# EasyEDA Pro project 独轮驱动.epro

# Schematic 独轮驱动
Create Date: 2024-05-19; Page Name: P1; Project Name: 独轮驱动; Schematic Name: 独轮驱动; Update Date: 2024-06-09; Company: 嘉立创EDA; Page Size: A3; Version: V1.0
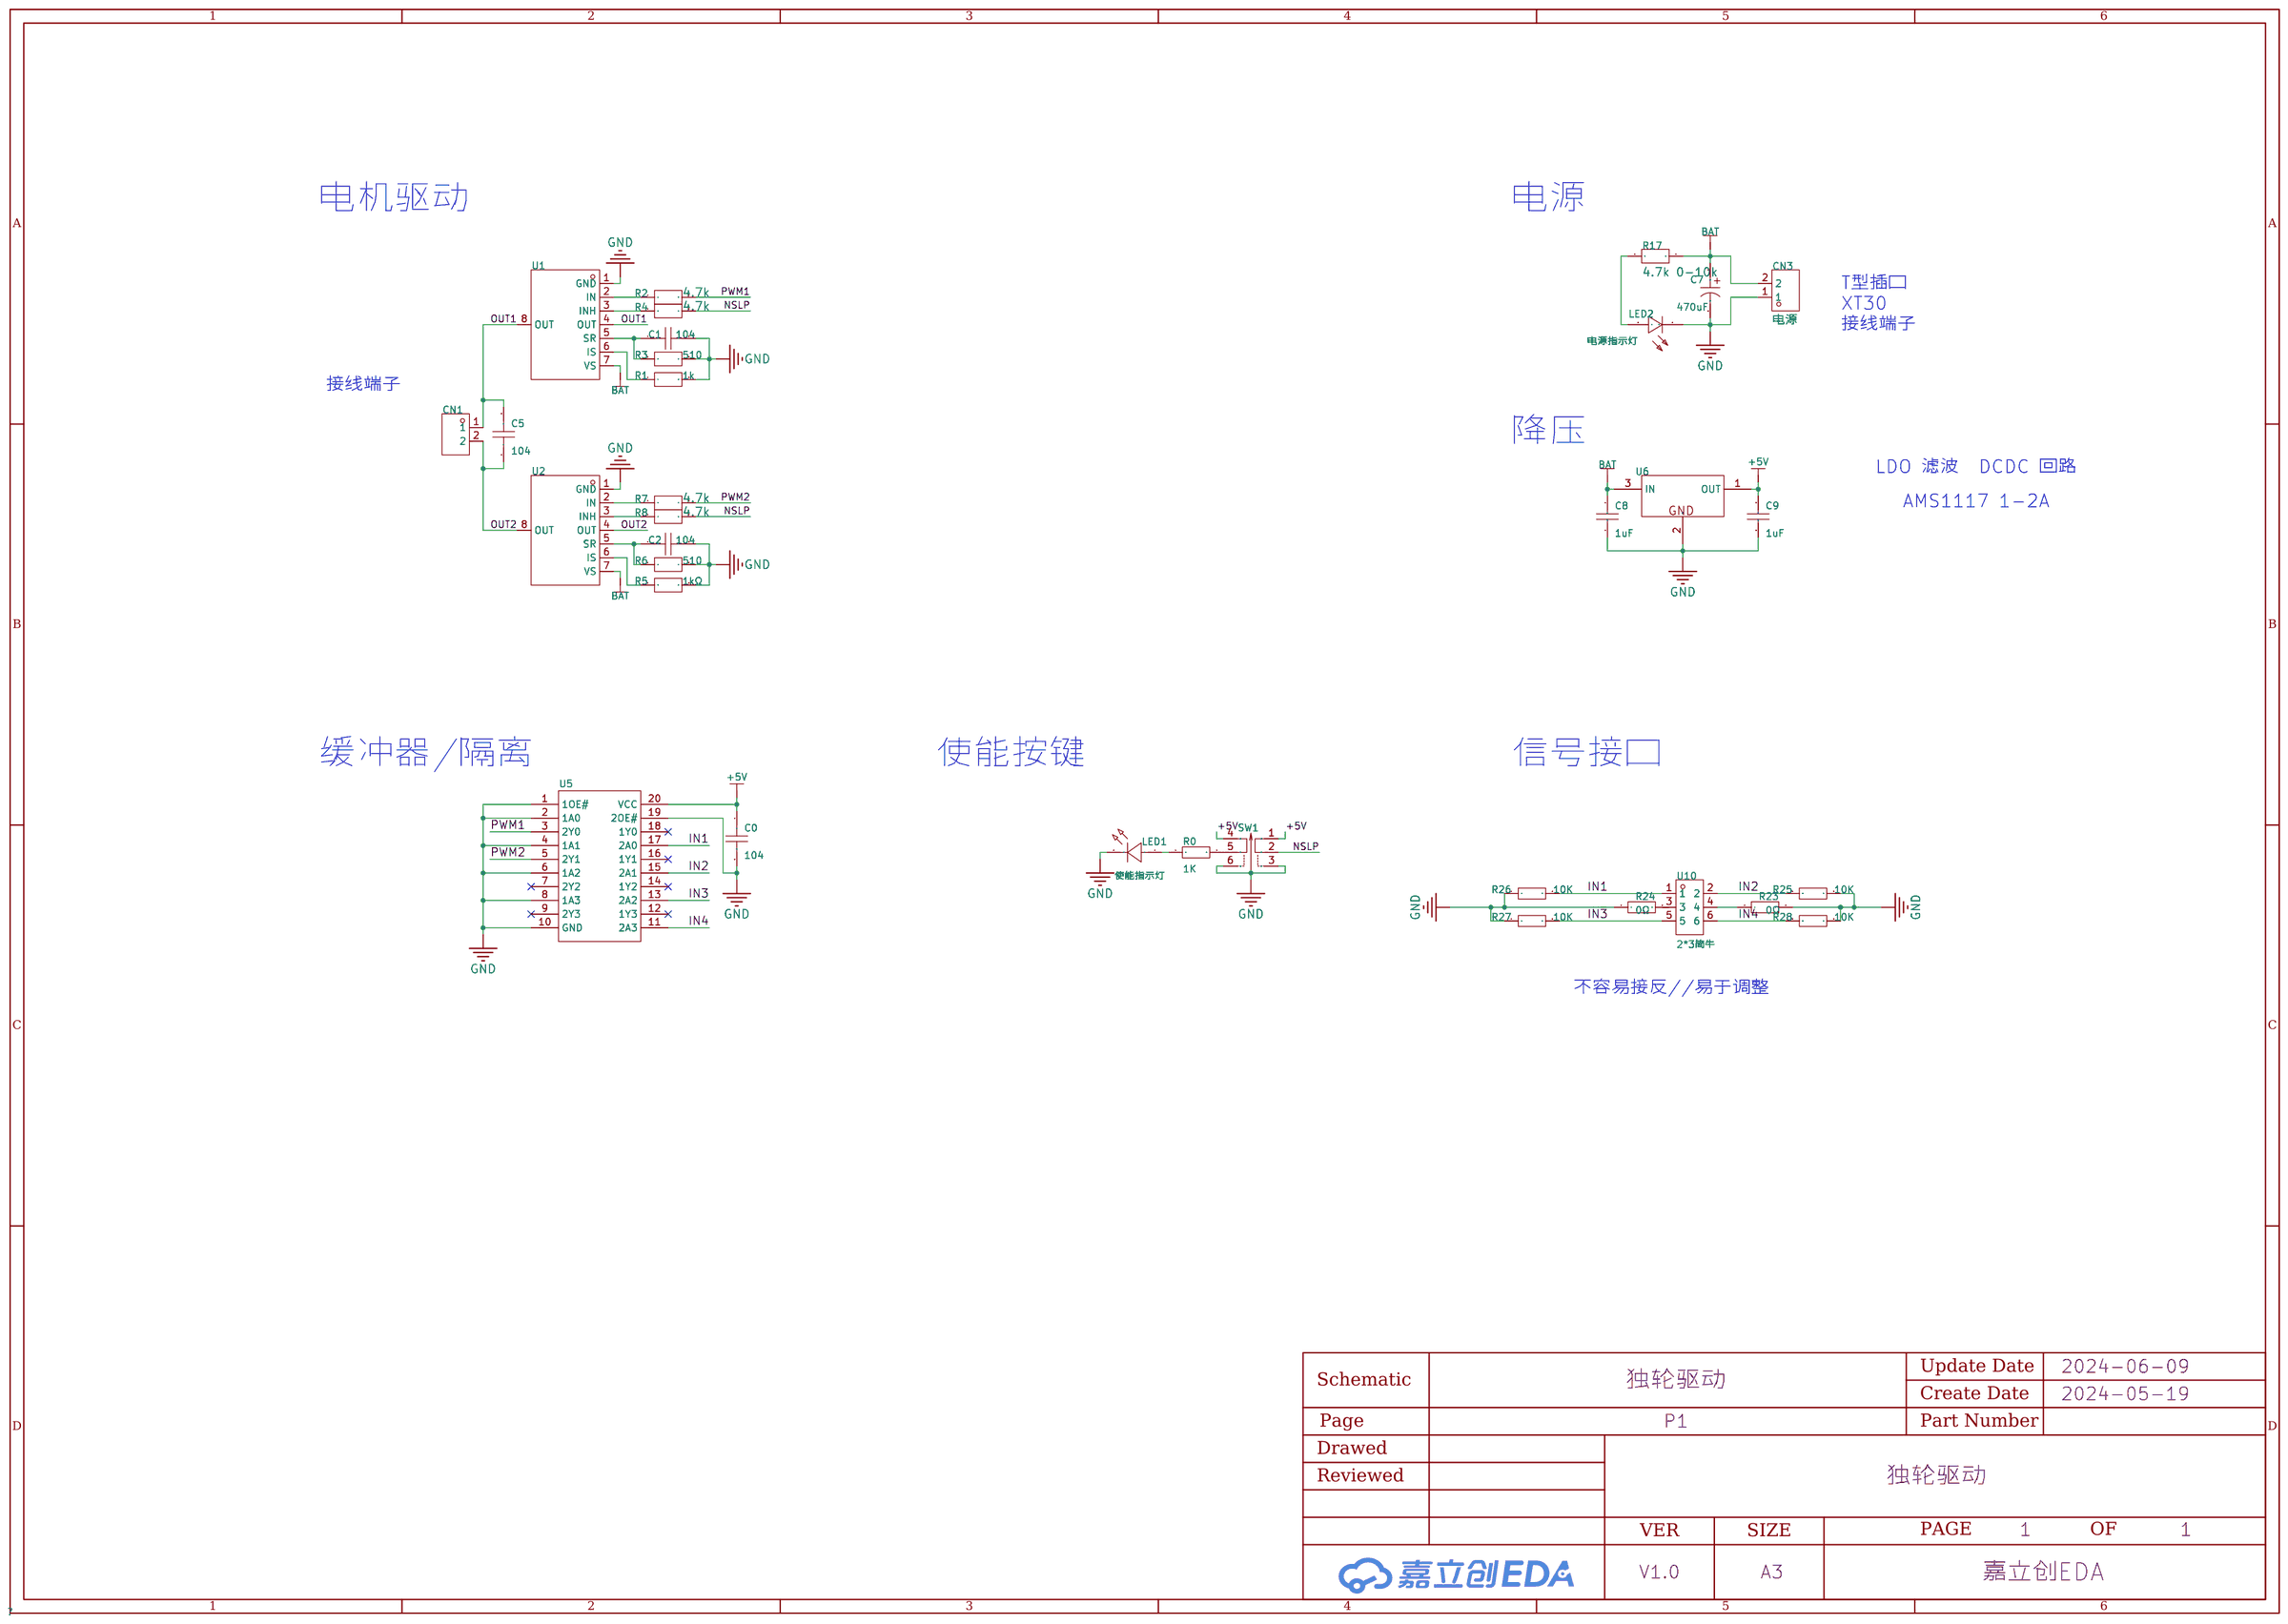
[diagram p0: schematic sheet]

## Parts
C0  104  [C0603]
C1  104  [C0603_1]
C2  104  [C0603_1]
C5  104  [C0603_1]
C7  470uF  [CAP-SMD_BD8.0-L8.3-W8.3-LS9.1-FD]
C8  1uF  [C0603_1]
C9  1uF  [C0603_1]
CN1  电机1  [CONN-TH_XT30U-M_1]
CN3  电源  [CONN-TH_XT30U-M_1]
LED1  使能指示灯  [LED-SMD_L1.6-W0.8-FD_GREEN]
LED2  电源指示灯  [LED0603-RD_RED]
R0  1K  [R0603]
R1  1k  [R0603]
R2  4.7k  [R0603]
R3  510  [R0603]
R4  4.7k  [R0603]
R5  1kΩ  [R0603]
R6  510  [R0603]
R7  4.7k  [R0603]
R8  4.7k  [R0603]
R17  4.7k 0-10k  [R0603]
R23  0Ω  [r0603_1]
R24  0Ω  [r0603_1]
R25  10K  [r0603_1]
R26  10K  [r0603_1]
R27  10K  [r0603_1]
R28  10K  [r0603_1]
SW1  使能开关  [SW-TH_6P-L5.8-W5.8-P2.00-LS4.5-BL]
U1  BTN7971BAUMA1  [TO-263-7_L10.2-W10.4-P1.27-LS14.4-BR]
U2  BTN7971BAUMA1  [TO-263-7_L10.2-W10.4-P1.27-LS14.4-BR]
U5  74HC244PW,118  [TSSOP-20_L6.5-W4.4-P0.65-LS6.4-BL]
U6  -  [SOT-89-3_L4.5-W2.5-P1.50-LS4.2-BR]
U10  2*3简牛  [CONN-TH_6P-P2.54_KINGHELM_KH-2.54PH180-2X3P-L8.9]

## Library data of the parts
C0-C2 C5 = CAP_604: 容值:100nF;精度:±10%;额定电压:50V;温度系数:X7R;; Supplier Footprint: 0603
C7 = RVT1E471M0810: 容值:470uF;精度:±20%;额定电压:25V;电容体直径:-;电容体长度:-;纹波电流:-;等效串联电阻:-;工作寿命:-;; LCSC Part Name: 470uF ±20% 25V; Supplier Part: C696190; Manufacturer: HONOR(荣誉); Supplier Footprint: SMD,D8xL10.2mm; JLCPCB Part Class: 扩展库; Datasheet: https://atta.szlcsc.com/upload/public/pdf/source/20210521/C113284_25C86AE95FB541053FE695F13EA8E7D0.pdf; Supplier: LCSC; Tolerance: ±20%; Rated Voltage: 25V
C8 C9 = CL10A105KB8NNNC: 温度系数:X5R;精度:±10%;额定电压:50V;容值:1uF;; LCSC Part Name: 1uF(105)±10%50V; Supplier Part: C15849; Manufacturer: SAMSUNG(三星); Supplier Footprint: 0603; JLCPCB Part Class: 基础库; Datasheet: https://atta.szlcsc.com/upload/public/pdf/source/20160103/1457707679084.pdf; Supplier: LCSC; Temperature Coefficient: X5R; Tolerance: ±10%; Voltage Rated: 50V
CN1 CN3 = KF301-5.0-2P: 间距:5mm;排数:1;每排PIN数:2;安装方式:直针;额定电流:17A;额定电压:250V;线规 - AWG:14~22;线规 - mm?:1.5;工作温度范围:-30~+120;颜色:蓝色;; LCSC Part Name: 5mm 排数:1 每排P数:2 直针 可拼接 铜 环保; Supplier Part: C474881; Manufacturer: KEFA(科发); Supplier Footprint: P=5mm; JLCPCB Part Class: 扩展库; Datasheet: https://atta.szlcsc.com/upload/public/pdf/source/20200115/C474881_883EFE2003339C40FD1BEEEFC9A18423.pdf; Supplier: LCSC; Pitch: 5mm; Number of Rows: 1; Number of PINs Per Row: 2; Mounting Style: 直针; Current Rating (Max): 17A; Voltage Rating (Max): 250V; Wire Gauge - AWG: 14~22; Wire Gauge - mm?: 1.5; Operating Temperature Range: -30~+120; Color: 蓝色
LED1 = 19-213/GVC-AMNB/3T: LCSC Part Name: 绿色; Supplier Part: C883167; Manufacturer: EVERLIGHT(台湾亿光); Supplier Footprint: 0603; JLCPCB Part Class: 扩展库; Datasheet: https://atta.szlcsc.comnull; Supplier: LCSC
LED2 = NCD0603R1_C84263: 发光颜色:红灯;; LCSC Part Name: 红灯; Supplier Part: C84263; Manufacturer: 国星光电; Manufacturer Part: NCD0603R1; Supplier Footprint: 0603; JLCPCB Part Class: 扩展库; Datasheet: https://atta.szlcsc.com/upload/public/pdf/source/20200820/C84263_DABC6A75E58F576973B407FDBA283D60.pdf; Supplier: LCSC; Emitted Color: 红灯
R0 = Res_0603: Supplier Footprint: 0603
R1 R3 R6 = FRC0603J511 TS: 电阻类型:厚膜电阻;阻值:510Ω;精度:±5%;功率:100mW;温度系数:±100ppm/;最大工作电压:50V;工作温度范围:-55~+155;; LCSC Part Name: 510Ω ±5% 100mW; Supplier Part: C2907179; Manufacturer: FOJAN(富捷); Supplier Footprint: 0603; Datasheet: https://atta.szlcsc.com/upload/public/pdf/source/20211102/08480A48F159CF742D398A1E4DC90941.pdf; Supplier: LCSC; Type: 厚膜电阻; Tolerance: ±5%; Power(Watts): 100mW; Temperature Coefficient: ±100ppm/; Overload Voltage (Max): 50V; Operating Temperature Range: -55~+155
R2 R4 R7 R8 R17 = FRC0603J472 TS: LCSC Part Name: 4.7KΩ ±5%; Supplier Part: C2907166; Manufacturer: FOJAN(富捷); Supplier Footprint: 0603; JLCPCB Part Class: 扩展库; Datasheet: https://atta.szlcsc.com/upload/public/pdf/source/20211102/08480A48F159CF742D398A1E4DC90941.pdf; Supplier: LCSC
R5 = FRC0603J102 TS: 电阻类型:厚膜电阻;阻值:1kΩ;精度:±5%;功率:100mW;温度系数:±100ppm/;最大工作电压:50V;工作温度范围:-55~+155;; LCSC Part Name: 1kΩ ±5% 100mW; Supplier Part: C2907113; Manufacturer: FOJAN(富捷); Supplier Footprint: 0603; JLCPCB Part Class: 扩展库; Datasheet: https://atta.szlcsc.com/upload/public/pdf/source/20211102/08480A48F159CF742D398A1E4DC90941.pdf; Supplier: LCSC; Type: 厚膜电阻; Tolerance: ±5%; Power(Watts): 100mW; Temperature Coefficient: ±100ppm/; Overload Voltage (Max): 50V; Operating Temperature Range: -55~+155
R23-R28 = ERJ3GEY0R00V: 电阻类型:厚膜电阻;阻值:0Ω;精度:-;功率:100mW;温度系数:-;最大工作电压:150V;工作温度范围:-55~+155;; LCSC Part Name: 0Ω 100mW; Supplier Part: C122704; Manufacturer: PANASONIC(松下); Supplier Footprint: 0603; JLCPCB Part Class: 扩展库; Datasheet: https://atta.szlcsc.com/upload/public/pdf/source/20171106/C122704_15099694152271094016.pdf; Supplier: LCSC; Type: 厚膜电阻; Power(Watts): 100mW; Overload Voltage (Max): 150V; Operating Temperature Range: -55~+155
SW1 = PB22E60L: 触点电流:500mA;额定电压 (AC):-;额定电压 (DC):50V;绝缘电阻:100MΩ;电路结构:双刀双掷;安装方式:直插;自锁/无锁:-;按键形状:方形柱塞;按键/盖帽颜色:白色;带灯:-;引脚样式:PC引脚;作用力:180gf@±50gf;防护等级:-;工作温度:-40~+85;机械寿命:30000;; LCSC Part Name: 自锁开关; Supplier Part: C2987421; Manufacturer: CIKI(皓富); Supplier Footprint: 插件; JLCPCB Part Class: 扩展库; Datasheet: https://atta.szlcsc.com/upload/public/pdf/source/20220408/7804C2A84B830DBCF70465BF0AEFEFAC.pdf; Supplier: LCSC; Contact Current: 500mA; Voltage Rating (DC): 50V; Insulation Resistance: 100MΩ; Circuit: 双刀双掷; Mounting Style: 直插; Actuator Style: 方形柱塞; Actuator/Cap Color: 白色; Pin Style: PC引脚; Operating Force: 180gf@±50gf; Operating Temperature: -40~+85; Mechanical Life: 30000
U1 U2 = BTN7971BAUMA1: Supplier Part: C69297; Manufacturer: Infineon(英飞凌); Supplier Footprint: TO-263-7; JLCPCB Part Class: 扩展库; Datasheet: https://atta.szlcsc.comnull; Supplier: LCSC
U5 = 74HC244PW,118: Supplier Part: C5623; Manufacturer: Nexperia(安世); Supplier Footprint: TSSOP-20; JLCPCB Part Class: 扩展库; Datasheet: https://atta.szlcsc.com/upload/public/pdf/source/20120413/1457706470018.pdf; Supplier: LCSC
U6 = UMW78L05: Supplier Part: C347258; Manufacturer: UMW(友台半导体); Supplier Footprint: SOT-89; JLCPCB Part Class: 扩展库; Datasheet: https://atta.szlcsc.com/upload/public/pdf/source/20190326/C347258_49F40F3DBDAE0D5716334DB8D4B2CA4D.pdf; Supplier: LCSC
U10 = KH-2.54PH180-2X3P-L8.9: 连接器类型:简牛座;间距:2.54mm;每排PIN数:3;排数:2;封装形式:直插;; LCSC Part Name: 2.54mm 每排P数:3 排数:2; Supplier Part: C5157626; Manufacturer: kinghelm(金航标); Supplier Footprint: 插件,P=2.54mm; Datasheet: https://atta.szlcsc.com/upload/public/pdf/source/20220902/B59B6B538EA7651002CBD3760F447B01.pdf; Supplier: LCSC; Connector Type: 简牛座; Pitch: 2.54mm; Pin Number in each Row: 3; Number of Rows: 2; Holder Type: 直插

## Nets
+5V: C0.1 C9.2 SW1.1 SW1.4 U5.20(VCC) U6.1(OUT)
GND: C0.2 C1.2 C2.2 C7.2 C8.1 C9.1 CN3.1 LED1.2(A) LED2.1(K) R1.2 R3.2 R5.2 R6.2 R23.2 R24.1 R25.2 R26.1 R27.1 R28.2 SW1.3 SW1.6 U1.1(GND) U2.1(GND) U5.1(1OE#) U5.2(1A0) U5.4(1A1) U5.6(1A2) U5.8(1A3) U5.10(GND) U5.19(2OE#) U6.2(GND)
BAT: C7.1 C8.2 CN3.2 R17.1 U1.7(VS) U2.7(VS) U6.3(IN)
IN1: R26.2 U5.17(2A0) U10.1
IN2: R25.1 U5.15(2A1) U10.2
IN3: R27.2 U5.13(2A2) U10.5
IN4: R28.1 U5.11(2A3) U10.6
NSLP: R4.2 R8.2 SW1.2
OUT1: C5.2 CN1.1 U1.4(OUT) U1.8(OUT)
OUT2: C5.1 CN1.2 U2.4(OUT) U2.8(OUT)
PWM1: R2.2 U5.3(2Y0)
PWM2: R7.2 U5.5(2Y1)
$1N1803: R0.2 SW1.5
$1N1806: LED1.1(K) R0.1
$1N1823: R8.1 U2.3(INH)
$1N1824: R7.1 U2.2(IN)
$1N1844: R2.1 U1.2(IN)
$1N1845: R4.1 U1.3(INH)
$1N1857: LED2.2(A) R17.2
$1N1871: R5.1 U2.6(IS)
$1N1873: C2.1 R6.1 U2.5(SR)
$1N1874: R1.1 U1.6(IS)
$1N1875: C1.1 R3.1 U1.5(SR)
$1N2062: R23.1 U10.4
$1N2143: R24.2 U10.3

Not connected (* = marked no-connect by the designer): U5 7(2Y2)* 9(2Y3)* 12(1Y3)* 14(1Y2)* 16(1Y1)* 18(1Y0)*

## Notes on the sheet
- 电机驱动
- 电源
- T型插口
  XT30
  接线端子
- 接线端子
- 降压
- LDO 滤波  DCDC 回路
- AMS1117 1-2A
- 缓冲器/隔离
- 使能按键
- 信号接口
- 不容易接反//易于调整

# Board 独轮驱动
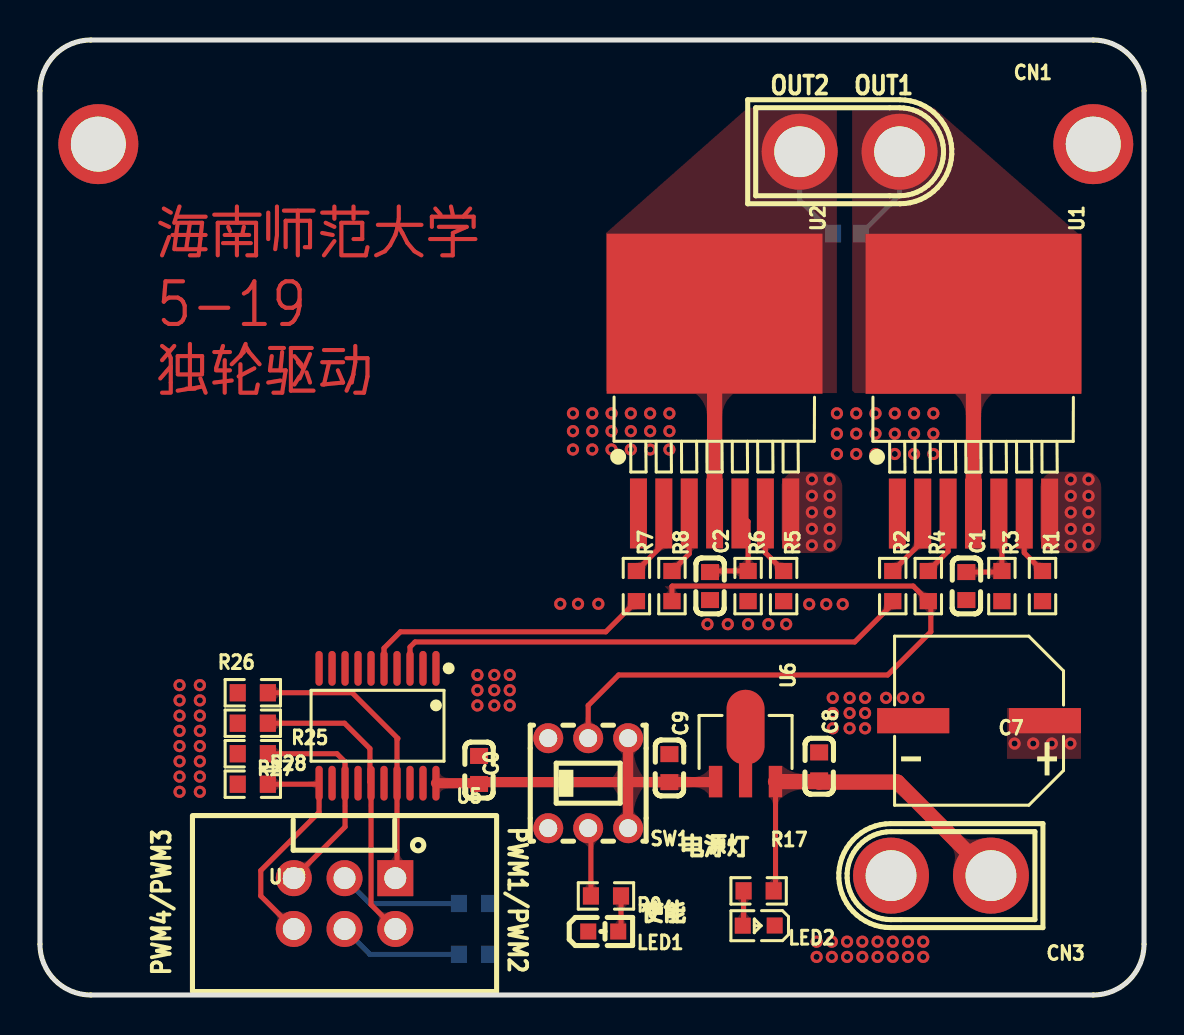
[diagram p1: board, top side]
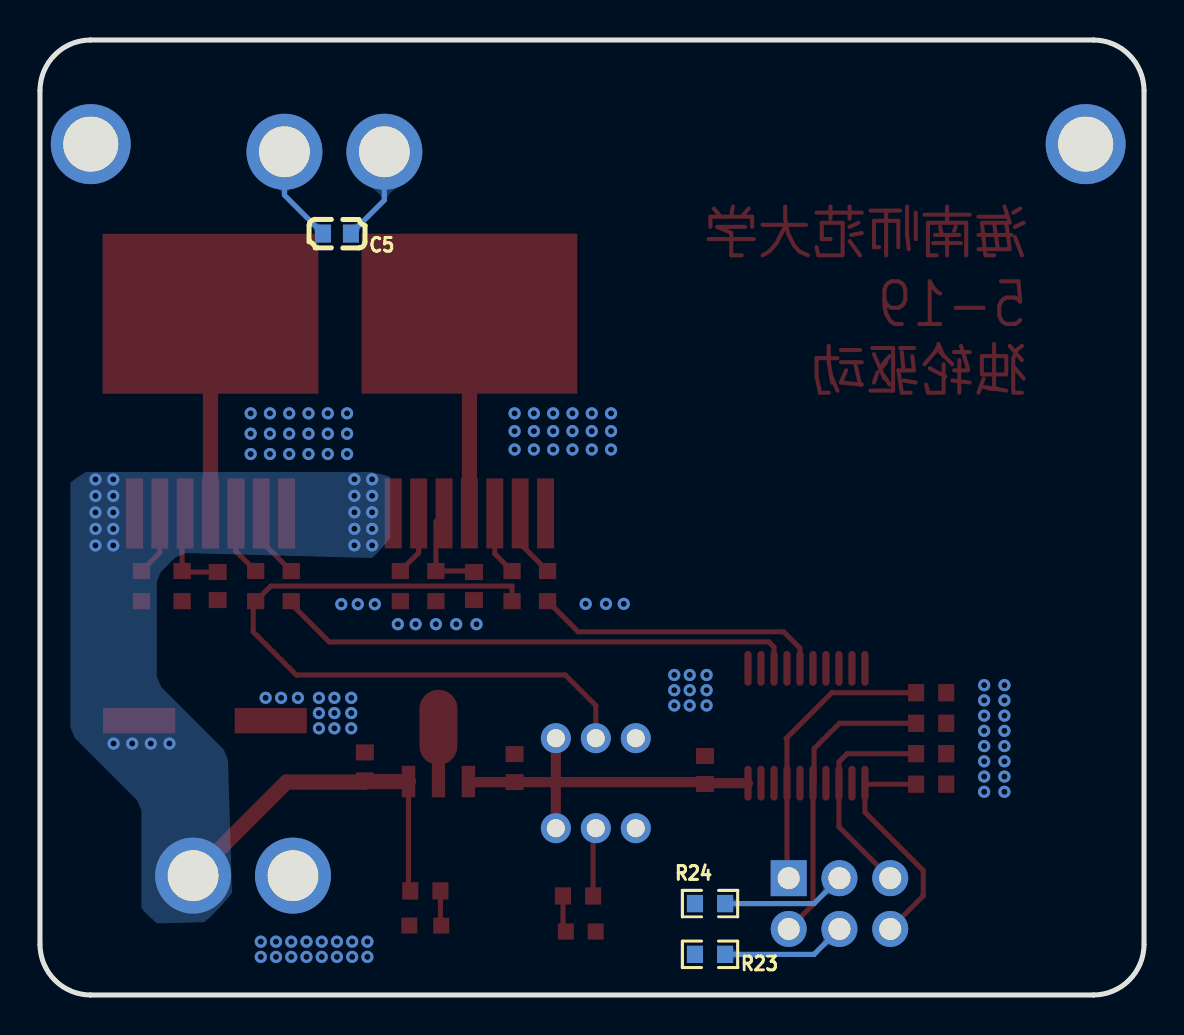
[diagram p2: board, bottom side, seen from below]

Outline 55.25 x 47.75 mm; copper layers: Top Layer, Bottom Layer. Coordinates in mm from the lower left corner of the outline.
Outline path: 0,45.21 0,2.54 arc(0.74,0.74) 2.54,0 52.71,0 arc(54.5,0.74) 55.25,2.54 55.25,45.21 arc(54.5,47.01) 52.71,47.75 2.54,47.75 arc(0.74,47.01) 0,45.21
Stack: Top Layer 0.035mm / Dielectric1 1.51mm FR4 er 4.5 / Bottom Layer 0.035mm

## Design rules (mm)
template: 自定义配置
spacing copperThickness1oz (default): track to track 0.102, other pairs 0.152 to 0.3
spacing copperThickness2oz: track to track 0.203, other pairs 0.152 to 0.3
track width copperThickness1oz (default): min 0.127, default 0.254, max 2.54
track width copperThickness2oz: min 0.203, default 0.254, max 2.54
differential pair differentialPair (default): width min 0.127, default 0.254, max 2.54; gap min 0.152, default 0.152
via viaSize (default): diameter min 0.5, default 0.61, max 10; hole min 0.3, default 0.305, max 6.3
net GND uses 10mile直连

## Placement (name value [footprint] x y rotation side)
C0  104  [C0603]  21.97 11.25 90 top
C1  104  [C0603_1]  46.35 20.45 270 top
C2  104  [C0603_1]  33.53 20.45 270 top
C5  104  [C0603_1]  40.39 38.07 0 bottom
C7  470uF  [CAP-SMD_BD8.0-L8.3-W8.3-LS9.1-FD]  46.99 13.72 180 top
C8  1uF  [C0603_1]  38.99 11.43 270 top
C9  1uF  [C0603_1]  31.5 11.35 270 top
CN1  电机1  [CONN-TH_XT30U-M_1]  40.51 42.16 0 top
CN3  电源  [CONN-TH_XT30U-M_1]  45.09 5.97 180 top
LED1  使能指示灯  [LED-SMD_L1.6-W0.8-FD_GREEN]  28.18 3.17 180 top
LED2  电源指示灯  [LED0603-RD_RED]  35.96 3.47 180 top
NOREF  -  [Pad_e661]  2.92 42.55 0 top
NOREF#2  -  [Pad_e660]  52.71 42.55 0 top
R0  1K  [R0603]  28.32 4.95 180 top
R1  1k  [R0603]  50.16 20.45 270 top
R2  4.7k  [R0603]  42.67 20.45 270 top
R3  510  [R0603]  48.13 20.45 270 top
R4  4.7k  [R0603]  44.45 20.45 270 top
R5  1kΩ  [R0603]  37.21 20.45 270 top
R6  510  [R0603]  35.43 20.45 270 top
R7  4.7k  [R0603]  29.84 20.45 270 top
R8  4.7k  [R0603]  31.62 20.45 270 top
R17  4.7k 0-10k  [R0603]  35.96 5.21 180 top
R23  0Ω  [r0603_1]  21.72 2.03 0 bottom
R24  0Ω  [r0603_1]  21.72 4.57 180 bottom
R25  10K  [r0603_1]  10.65 13.59 180 top
R26  10K  [r0603_1]  10.65 15.11 0 top
R27  10K  [r0603_1]  10.65 12.06 0 top
R28  10K  [r0603_1]  10.65 10.54 180 top
SW1  使能开关  [SW-TH_6P-L5.8-W5.8-P2.00-LS4.5-BL]  27.43 10.59 180 top
U1  BTN7971BAUMA1  [TO-263-7_L10.2-W10.4-P1.27-LS14.4-BR]  46.71 29.07 270 top
U2  BTN7971BAUMA1  [TO-263-7_L10.2-W10.4-P1.27-LS14.4-BR]  33.76 29.07 270 top
U5  74HC244PW,118  [TSSOP-20_L6.5-W4.4-P0.65-LS6.4-BL]  16.89 13.46 180 top
U6  -  [SOT-89-3_L4.5-W2.5-P1.50-LS4.2-BR]  35.31 12.03 270 top
U10  2*3简牛  [CONN-TH_6P-P2.54_KINGHELM_KH-2.54PH180-2X3P-L8.9]  15.24 4.57 180 top

## Footprints (pads in the part's own frame, mm; a bottom-side part is the same pattern mirrored in y, then rotated)
C0603
  rect 0.8x0.9 smd: 1(-0.7,0) 2(0.7,0)
C0603_1
  rect 0.8x0.9 smd: 1(-0.7,0) 2(0.7,0)
CAP-SMD_BD8.0-L8.3-W8.3-LS9.1-FD
  rect 3.61x1.26 smd: 1(-3.295,0) 2(3.295,0)
CONN-TH_6P-P2.54_KINGHELM_KH-2.54PH180-2X3P-L8.9
  rect 1.8x1.8 hole 1.1: 1(-2.54,-1.27)
  round 1.8 hole 1.1: 2(-2.54,1.27) 3(0,-1.27) 4(0,1.27) 5(2.54,-1.27) 6(2.54,1.27)
CONN-TH_XT30U-M_1
  round 3.8 hole 2.54: 1(2.5,0) 2(-2.5,0)
LED0603-RD_RED
  rect 0.8x0.8 smd: 1(-0.799,-0.004) 2(0.799,0.004)
LED-SMD_L1.6-W0.8-FD_GREEN
  rect 0.8x0.8 smd: 1(-0.75,0) 2(0.75,0)
Pad_e660
  round 4 hole 2.75: 4(0,0)
Pad_e661
  round 4 hole 2.75: 4(0,0)
R0603
  rect 0.806x0.864 smd: 1(-0.753,0) 2(0.753,0)
r0603_1
  rect 0.806x0.864 smd: 1(-0.753,0) 2(0.753,0)
SOT-89-3_L4.5-W2.5-P1.50-LS4.2-BR
  rect 1.575x0.672 smd: 1(1.356,-1.5) 3(1.356,1.5)
  custom 5.377x1.9 smd: 2(-1.356,0)
SW-TH_6P-L5.8-W5.8-P2.00-LS4.5-BL
  round 1.5 hole 0.9: 1(-2,-2.25) 2(0,-2.25) 3(2,-2.25) 4(-2,2.25) 5(0,2.25) 6(2,2.25)
TO-263-7_L10.2-W10.4-P1.27-LS14.4-BR
  rect 3.5x0.85 smd: 1(4.995,-3.81) 2(4.995,-2.54) 3(4.995,-1.27) 4(4.995,0) 5(4.995,1.27) 6(4.995,2.54) 7(4.995,3.81)
  rect 8x10.8 smd: 8(-4.995,0)
TSSOP-20_L6.5-W4.4-P0.65-LS6.4-BL
  oval 0.364x1.742 smd: 1(-2.925,-2.871) 2(-2.275,-2.871) 3(-1.625,-2.871) 4(-0.975,-2.871) 5(-0.325,-2.871) 6(0.325,-2.871) 7(0.975,-2.871) 8(1.625,-2.871) 9(2.275,-2.871) 10(2.925,-2.871) 11(2.925,2.871) 12(2.275,2.871) 13(1.625,2.871) 14(0.975,2.871) 15(0.325,2.871) 16(-0.325,2.871) 17(-0.975,2.871) 18(-1.625,2.871) 19(-2.275,2.871) 20(-2.925,2.871)

## Nets
As in the schematic.

Pads without a net: NOREF 4; NOREF#2 4; U5 7 9 12 14 16 18

## Via types
v1: diameter 0.61, hole 0.305, Top Layer to Bottom Layer, 124 vias

## Routing (per net, layer and track width the routed paths; a pad name or vN(x,y) marks a point on that pad's centre or on a via; arc(x,y) is an arc through that point)
+5V: length 18.4
  Top Layer w0.254: 33.81,10.67 33.78,10.65
  Top Layer w0.508: SW1.4 29.43,10.65 ; 29.43,10.65 SW1.1 ; 29.43,10.65 C9.2 33.78,10.65 ; 29.43,10.65 22.06,10.65 ; 21.93,10.59 19.82,10.59
GND:
  vias: v1(6.98,15.49) v1(6.98,14.73) v1(6.98,13.97) v1(6.98,13.21) v1(6.98,12.45) v1(6.98,11.68) v1(6.98,10.92) v1(6.98,10.16) v1(8,15.49) v1(8,14.73) v1(8,13.97) v1(8,13.21) v1(8,12.45) v1(8,11.68) v1(8,10.92) v1(8,10.16) v1(21.89,16) v1(21.89,15.24) v1(21.89,14.48) v1(22.73,16) v1(22.73,15.24) v1(22.73,14.48) v1(23.51,16) v1(23.51,15.24) v1(23.51,14.48) v1(26.03,19.56) v1(26.67,29.08) v1(26.67,28.19) v1(26.67,27.28) v1(26.92,19.56) v1(27.63,29.08) v1(27.63,28.19) v1(27.63,27.28) v1(27.94,19.56) v1(28.6,29.08) v1(28.6,28.19) v1(28.6,27.28) v1(29.57,29.08) v1(29.57,28.19) v1(29.57,27.28) v1(30.53,29.08) v1(30.53,28.19) v1(30.53,27.28) v1(31.5,29.08) v1(31.5,28.19) v1(31.5,27.28) v1(33.4,18.54) v1(34.42,18.54) v1(35.43,18.54) v1(36.45,18.54) v1(37.34,18.54) v1(38.49,19.54) v1(38.86,2.67) v1(38.86,1.91) v1(39.34,19.54) v1(39.62,2.67) v1(39.62,1.91) v1(39.67,14.86) v1(39.67,14.1) v1(39.67,13.33) v1(39.88,29.08) v1(39.88,28.07) v1(39.88,27.05) v1(40.17,19.54) v1(40.39,2.67) v1(40.39,1.91) v1(40.51,14.86) v1(40.51,14.1) v1(40.51,13.33) v1(40.84,29.08) v1(40.84,28.07) v1(40.84,27.05) v1(41.15,2.67) v1(41.15,1.91) v1(41.29,14.86) v1(41.29,14.1) v1(41.29,13.33) v1(41.81,29.08) v1(41.81,28.07) v1(41.81,27.05) v1(41.91,2.67) v1(41.91,1.91) v1(42.34,14.86) v1(42.67,2.67) v1(42.67,1.91) v1(42.77,29.08) v1(42.77,28.07) v1(42.77,27.05) v1(43.18,14.86) v1(43.43,2.67) v1(43.43,1.91) v1(43.74,29.08) v1(43.74,28.07) v1(43.74,27.05) v1(43.95,14.86) v1(44.2,2.67) v1(44.2,1.91) v1(44.7,29.08) v1(44.7,28.07) v1(44.7,27.05)
BAT: length 17.8
  Top Layer w0.254: 42.78,10.77 42.91,10.65 ; R17.1 36.81,5.3 36.81,10.04
  Top Layer w0.762: 36.81,10.67 38.96,10.67 38.99,10.65 42.91,10.65 CN3.2
  vias: v1(38.62,25.79) v1(38.62,24.96) v1(38.62,24.14) v1(38.62,23.31) v1(38.62,22.48) v1(39.51,25.79) v1(39.51,24.96) v1(39.51,24.14) v1(39.51,23.31) v1(39.51,22.48) v1(48.77,12.57) v1(49.7,12.57) v1(50.63,12.57) v1(51.58,25.78) v1(51.58,24.96) v1(51.58,24.13) v1(51.58,23.3) v1(51.58,22.48) v1(51.56,12.57) v1(52.47,25.78) v1(52.47,24.96) v1(52.47,24.13) v1(52.47,23.3) v1(52.47,22.48)
IN1: length 14.5
  Top Layer w0.254: U10.1 17.87,5.93 17.87,12.79 17.91,12.83 15.62,15.11 R26.2
IN2: length 15.2
  Top Layer w0.254: U10.2 16.57,4.52 16.57,10.59 16.51,10.65 16.51,12.32 15.24,13.59 R25.1
IN3: length 10.9
  Top Layer w0.254: R27.2 14.86,12.06 15.27,11.66 15.27,8.41 U10.5
IN4: length 11.8
  Top Layer w0.254: R28.1 13.92,10.54 13.97,10.59 13.97,9.14 11.05,6.22 11.05,4.95 U10.6
NSLP: length 35.8
  Top Layer w0.254: R8.2 31.62,20.44 31.63,20.45 43.7,20.45 R4.2 44.58,19.57 44.58,18.16 42.42,16 28.96,16 27.43,14.48 SW1.2
OUT1: length 14.9
  Top Layer w0.762: U1.8 U1.4
  Bottom Layer w0.254: C5.2 43.01,40 CN1.1
OUT2: length 14.8
  Top Layer w0.762: U2.8 U2.4
  Bottom Layer w0.254: C5.1 38.01,39.74 CN1.2
PWM1: length 26.3
  Top Layer w0.254: R2.2 42.67,19.56 40.77,17.65 18.77,17.65 18.52,17.4 U5.3
PWM2: length 14.6
  Top Layer w0.254: U5.5 17.22,17.34 18.03,18.16 28.31,18.16 R7.2
$1N1803: length 3.4
  Top Layer w0.254: SW1.5 27.57,8.21 R0.2
$1N1806: length 1.8
  Top Layer w0.254: R0.1 29.07,3.32 LED1.1
$1N1823: length 3.2
  Top Layer w0.254: R8.1 32.49,22.06 U2.3
$1N1824: length 3.4
  Top Layer w0.254: R7.1 31.22,22.57 U2.2
$1N1844: length 3.5
  Top Layer w0.254: 44.17,24.07 44.17,22.7 R2.1
$1N1845: length 3.3
  Top Layer w0.254: R4.1 45.44,22.19 U1.3
$1N1857: length 1.8
  Top Layer w0.254: LED2.2 35.21,3.51 R17.2
$1N1871: length 3.3
  Top Layer w0.254: R5.1 36.3,22.11 U2.6
$1N1873: length 4.8
  Top Layer w0.254: U2.5 35.43,23.67 R6.1 35.43,21.2 33.66,21.2
$1N1874: length 3.3
  Top Layer w0.254: U1.6 49.25,22.11 R1.1
$1N1875: length 4.7
  Top Layer w0.254: C1.1 48.08,21.15 R3.1 48.13,23.92 U1.5
$1N2062: length 6.2
  Bottom Layer w0.254: U10.4 16.51,2.03 R23.1
$1N2143: length 6.2
  Bottom Layer w0.254: U10.3 16.51,4.57 R24.2

## Copper pours and planes (outline as drawn; the poured copper is in the pictures)
+5V on Top Layer: 28.44,11.57 30.35,11.57 30.35,9.74 28.44,9.74
GND on Top Layer: -8,-8.07 72.01,-8.07 72.01,53.14 -8,53.14
GND on Top Layer: -8.13,53.09 71.88,53.09 71.88,-8.13 -8.13,-8.13
GND on Top Layer: -1.65,-2.16 57.91,-2.16 57.91,49.78 -1.65,49.78
GND on Bottom Layer: -8,53.21 72.01,53.21 72.01,-8 -8,-8
BAT on Top Layer: 37.1,26.17 40.15,26.17 40.15,22.1 37.1,22.1
BAT on Top Layer: 50.05,26.16 53.1,26.16 53.1,22.1 50.05,22.1
BAT on Top Layer: 48.39,14.35 52.09,14.35 52.09,11.81 48.39,11.81
BAT on Bottom Layer: 37.72,26.15 53.72,26.15 53.72,3.58 37.72,3.58
OUT1 on Top Layer: 40.64,44.36 52.13,44.36 52.13,30.1 40.64,30.1
OUT2 on Top Layer: 28.32,44.36 39.88,44.36 39.88,30.1 28.32,30.1

Small or netless copper shapes (teardrops, artwork), in the pictures only: 66 on Top Layer, 8 on Bottom Layer

## Text on the board
Top Layer: 海南师范大学 / 5-19 / 独轮驱动
Top Silkscreen Layer: PWM1/PWM2 | PWM4/PWM3 | OUT2 | OUT1 | 使能 | 电源灯
